# Altium project LED PCB Project.PrjPcb
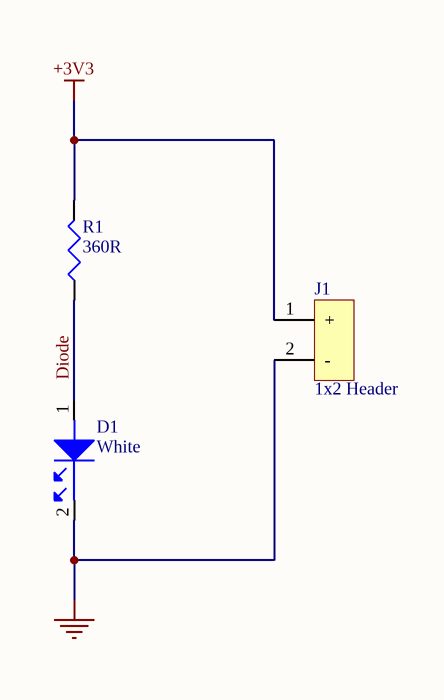
[diagram p0: LED.SchDoc]
1 sheet, 3 parts. Net scope: global (net labels, ports and power ports of the same name join across sheets).
Board file: LED.PcbDoc

## Sheet LED.SchDoc
size A4

### Parts
D1  White  [LED0603w]
J1  1x2 Header  [Header1x2]
R1  360R  [R0805]

### Nets
+3V3: J1.1(+) R1.3
GND: D1.2 J1.2(-)
Diode: D1.1 R1.4

### Library data of the parts
D1 = LNJ037X8ARA: PANASONIC - LNJ037X8ARA - LED WHITE HIGH BRIGHT ESS SMD; Manufacturer: Panasonic SSG; Number of LEDs: 1; Test Current: 5mA; Lens Style: Rectangular; Luminous Intensity: 60mcd; Forward Voltage: 2.9V; Forward Current: 10mA; Supplier 1: Digi-Key; Supplier Part Number 1: LNJ037X8ARACT-ND; Manufacturer Part Number: LNJ037X8ARA; RoHS: Yes; Category: LEDs; Stock 1: 77736; Pricing 1: 1=0.51000, 10=0.33900, 100=0.24310, 500=0.20394, 1000=0.19158 (USD); Mount: Surface Mount; Case/Package: 0603; Number of Pins: 2; Case Code (Metric): 1608; Color: White; Case Code (Imperial): 0603; Min Operating Temperature: -30°C; Max Operating Temperature: 85°C; Packaging: Cut Tape; Package Quantity: 5000; Illumination Color: White; Length: 1.6mm; Height: 0.2mm; Width: 0.8mm; Radiation Hardening: No; Lead Free: Lead Free; REACH SVHC: No SVHC; ComponentLink1URL: https://datasheet.ciiva.com/9326/lnj037x8ara-aek-9326742.pdf?src-supplier=Avnet; ComponentLink1Description: https://datasheet.ciiva.com/9326/lnj037x8ara-aek-9326742.pdf?src-supplier=Avnet; ComponentLink2URL: https://datasheet.ciiva.com/4690/lnj037x8ara-aek-226059-4690605.pdf?src-supplier=Mouser; ComponentLink2Description: https://datasheet.ciiva.com/4690/lnj037x8ara-aek-226059-4690605.pdf?src-supplier=Mouser; ComponentLink3URL: https://datasheet.ciiva.com/11773/0900766b80f0a8b4-11773901.pdf?src-supplier=RSComponents; ComponentLink3Description: https://datasheet.ciiva.com/11773/0900766b80f0a8b4-11773901.pdf?src-supplier=RSComponents
J1 = 22-29-2021: Conn Wire to Board HDR 2 POS 2.54mm Solder ST Thru-Hole Bag; Manufacturer: Molex; Number of Positions: 2; Connector Type: Header,Male Pin; Gender: Male; Voltage Rating (DC): 250V; Contact Post Length: 0.14inch; Glow Wire Compliant: Non-compliant; Supplier 1: Digi-Key; Supplier Part Number 1: WM2744-ND; Manufacturer Part Number: 22-29-2021; RoHS: Yes; Category: Headers and Wire Housings; Stock 1: 5199; Pricing 1: 1=0.48000, 10=0.45200, 100=0.31630, 500=0.27112, 1000=0.22593, 5000=0.19365, 10000=0.18074 (USD); Mount: Through Hole; Color: White; Contact Plating: Gold; Contact Material: Brass; Contact Shape: Square; Insulation Material: Nylon; Insulation Color: Natural; Max Operating Temperature: 80°C; Number of Rows: 1; Packaging: Bag; Termination: Solder; Fastening Type: Friction; Contact Mating Length: 0.295inch; Insulation Height: 0.461inch; Lead Free: Lead Free; Halogen Free: Low Halogen; Flammability Rating: UL94 V-0; ComponentLink1URL: https://datasheet.ciiva.com/70131/022292021-sd-70131706.pdf?src-supplier=Digi-Key; ComponentLink1Description: https://datasheet.ciiva.com/70131/022292021-sd-70131706.pdf?src-supplier=Digi-Key
R1 = CRCW0805360RFKEA: Res Thick Film 0805 360 Ohm 1% 0.125W(1/8W) ±100ppm/C Molded SMD Automotive Paper T/R; Manufacturer: Vishay; Temperature Coefficient: 100ppm/°C; Max Power Dissipation: 125mW; Voltage Rating (DC): 150V; Supplier 1: Digi-Key; Supplier Part Number 1: 541-360CCT-ND; Manufacturer Part Number: CRCW0805360RFKEA; RoHS: Yes; Category: Chip SMD Resistors; Stock 1: 26265; Pricing 1: 1=0.10000, 10=0.06000, 100=0.02450, 1000=0.01102, 2500=0.00957 (USD); Case/Package: 0805; Number of Pins: 2; Weight: 0.000194oz; Case Code (Metric): 2012; Case Code (Imperial): 0805; Contact Plating: Tin; Number of Terminals: 2; Min Operating Temperature: -55°C; Max Operating Temperature: 155°C; Resistance: 360R; Tolerance: 1%; Packaging: Tape and Reel; Composition: Thick Film; Package Quantity: 10; Number of Terminations: 2; Features: Automotive AEC-Q200; Power Rating: 125mW; Voltage Rating: 150V; Termination: SMD/SMT; Military Standard: Not; Length: 2mm; Height: 0.45mm; Width: 0.049inch; Depth: 1.25mm; Radiation Hardening: No; Lead Free: Lead Free; REACH SVHC: Unknown; ComponentLink1URL: https://datasheet.ciiva.com/2467/dcrcwe3-2467773.pdf?src-supplier=Digi-Key; ComponentLink1Description: https://datasheet.ciiva.com/2467/dcrcwe3-2467773.pdf?src-supplier=Digi-Key